# EAGLE design Main V3 (EAGLE 9.6.2)
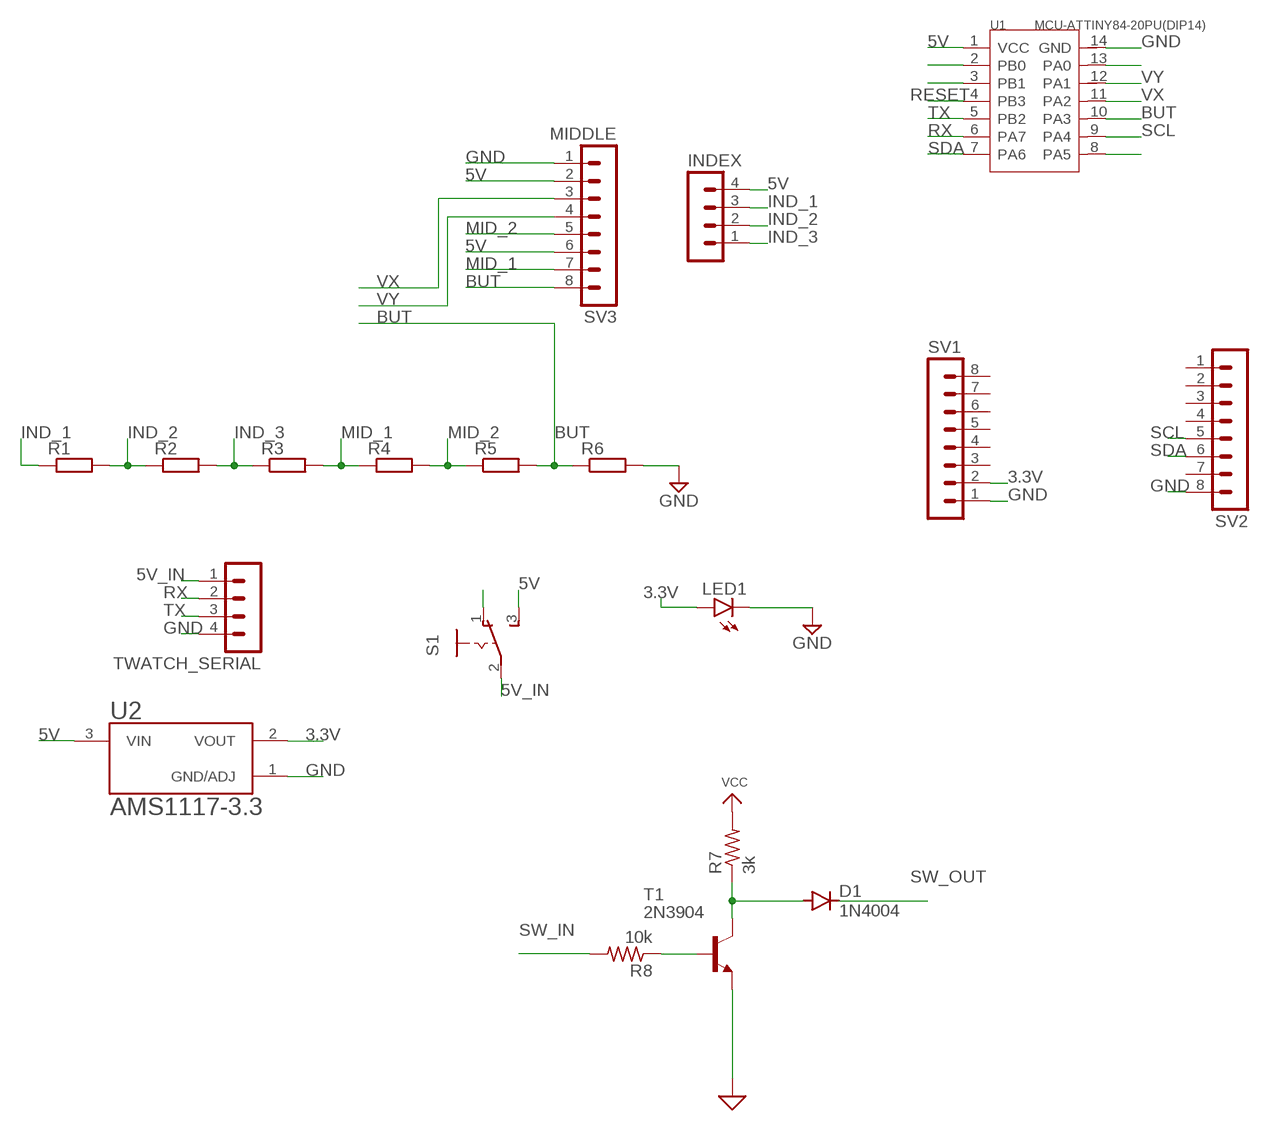
[diagram p0: schematic, sheet 1]

## Parts
D1  1N4004  [DO41-10]
INDEX  MA04-1  [MA04-1]
LED1  LED5MM  [LED5MM]
R1  R-EU_0204/7  [0204/7]
R2  R-EU_0204/7  [0204/7]
R3  R-EU_0204/7  [0204/7]
R4  R-EU_0204/7  [0204/7]
R5  R-EU_0204/7  [0204/7]
R6  R-EU_0204/7  [0204/7]
R7  3k  R-US_0204/5  [0204/5]
R8  10k  R-US_0204/5  [0204/5]
S1  255SB  [255SB]
SV1  MA08-1  [MA08-1]
SV2  MA08-1  [MA08-1]
SV3  MIDDLE  MA08-1  [MA08-1]
T1  2N3904  [TO92]
TWATCH_SERIAL  MA04-1  [MA04-1]
U1  MCU-ATTINY84-20PU(DIP14)  [DIP14-2.54-17.24X6.35MM]
U2  AMS1117-3.3  [SOT229P700X180-4N]

## Nets
3.3V: LED1.A SV1.2 U2.2(VOUT)
5V: INDEX.4 S1.3(S) SV3.2 SV3.6 U1.1(VCC) U2.3(VIN)
5V_IN: S1.2(P) TWATCH_SERIAL.1
BUT: R5.2 R6.1 SV3.8 U1.10(PA3)
GND: LED1.K(C) R6.2 SV1.1 SV2.8 SV3.1 T1.3(E) TWATCH_SERIAL.4 U1.14(GND) U2.1(GND/ADJ) ; supply symbol labelled SUP
IND_1: INDEX.3 R1.1
IND_2: INDEX.2 R1.2 R2.1
IND_3: INDEX.1 R2.2 R3.1
MID_1: R3.2 R4.1 SV3.7
MID_2: R4.2 R5.1 SV3.5
N$2: S1.1(O)
N$3: U1.2(PB0)
N$4: U1.3(PB1)
N$5: R8.1 T1.2(B)
N$6: D1.A R7.1 T1.1(C)
N$9: U1.8(PA5)
N$14: U1.13(PA0)
RESET: U1.4(PB3)
RX: TWATCH_SERIAL.2 U1.6(PA7)
SCL: SV2.5 U1.9(PA4)
SDA: SV2.6 U1.7(PA6)
SW_IN: R8.2
SW_OUT: D1.C
TX: TWATCH_SERIAL.3 U1.5(PB2)
VCC: R7.2
VX: SV3.3 U1.11(PA2)
VY: SV3.4 U1.12(PA1)
Unconnected: SV1.3 SV1.4 SV1.5 SV1.6 SV1.7 SV1.8 SV2.1 SV2.2 SV2.3 SV2.4 SV2.7

## Library data of the parts
D1 = diode:1N4004: DIODE general purpose rectifier, 1 A
INDEX TWATCH_SERIAL = con-lstb:MA04-1: PIN HEADER; OC_FARNELL: unknown; OC_NEWARK: unknown
LED1 = led:LED: LED OSRAM: - CHIPLED LG R971, LG N971, LY N971, LG Q971, LY Q971, LO R971, LY R971 LH N974, LH R974 LS Q976, LO Q976, LY Q976 LO Q996 - Hyper CHIPLED LW Q18S LB Q993, LB Q99A, LB R99A - SideLED LS A670, LO A670, LY A670, LG A670, LP A670 LB A673, LV A673, LT A673, LW A673 LH A674 LY A675 LS A676, LA A676, LO A676, LY A676, LW A676 LS A679, LY A679, LG A679 - Hyper Micro SIDELED® LS Y876, LA Y876, LO Y876, LY Y876 LT Y87S - SmartLED LW L88C, LW L88S LB L89C, LB L89S, LG L890 LS L89K, LO L89K, LY L89K LS L896, LA L896, LO L896, LY L896 - TOPLED LS T670, LO T670, LY T670, LG T670, LP T670 LSG T670, LSP T670, LSY T670, LOP T670, LYG T670 LG T671, LOG T671, LSG T671 LB T673, LV T673, LT T673, LW T673 LH T674 LS T676, LA T676, LO T676, LY T676, LB T676, LH T676, LSB T676, LW T676 LB T67C, LV T67C, LT T67C, LS T67K, LO T67K, LY T67K, LW E67C LS E67B, LA E67B, LO E67B, LY E67B, LB E67C, LV E67C, LT E67C LW T67C LS T679, LY T679, LG T679 LS T770, LO T770, LY T770, LG T770, LP T770 LB T773, LV T773, LT T773, LW T773 LH T774 LS E675, LA E675, LY E675, LS T675 LS T776, LA T776, LO T776, LY T776, LB T776 LHGB T686 LT T68C, LB T68C - Hyper Mini TOPLED® LB M676 - Mini TOPLED Santana® LG M470 LS M47K, LO M47K, LY M47K Source: http://www.osram.convergy.de LUXEON: - LUMILED® LXK2-PW12-R00, LXK2-PW12-S00, LXK2-PW14-U00, LXK2-PW14-V00 LXK2-PM12-R00, LXK2-PM12-S00, LXK2-PM14-U00 LXK2-PE12-Q00, LXK2-PE12-R00, LXK2-PE12-S00, LXK2-PE14-T00, LXK2-PE14-U00 LXK2-PB12-K00, LXK2-PB12-L00, LXK2-PB12-M00, LXK2-PB14-N00, LXK2-PB14-P00, LXK2-PB14-Q00 LXK2-PR12-L00, LXK2-PR12-M00, LXK2-PR14-Q00, LXK2-PR14-R00 LXK2-PD12-Q00, LXK2-PD12-R00, LXK2-PD12-S00 LXK2-PH12-R00, LXK2-PH12-S00 LXK2-PL12-P00, LXK2-PL12-Q00, LXK2-PL12-R00 Source: www.luxeon.com KINGBRIGHT: KA-3528ASYC Source: www.kingbright.com
R1-R6 = rcl:R-EU_: RESISTOR, European symbol; SPICEPREFIX: R
R7 R8 = resistor:R-US_: RESISTOR, American symbol
S1 = switch:255SB: SLIDING SWITCH Distributor Buerklin, 11G810
SV1-SV3 = con-lstb:MA08-1: PIN HEADER; OC_FARNELL: unknown; OC_NEWARK: unknown
T1 = transistor:2N3904: NPN TRANSISTOR
U1 = MCU-ATTINY84-20PU_DIP14_:MCU-ATTINY84-20PU(DIP14): 310010126 Check availability <https://pricing.snapeda.com/parts/ATTINY84-20PU/Microchip/view-part?ref=eda>; AVAILABILITY: In Stock; DESCRIPTION: AVR AVR® ATtiny Microcontroller IC 8-Bit 20MHz 8KB (4K x 16) FLASH 14-PDIP; MF: Microchip; MP: ATTINY84-20PU; PACKAGE: DIP-14 Microchip; PRICE: None; PURCHASE-URL: https://pricing.snapeda.com/search/part/ATTINY84-20PU/?ref=eda
U2 = AMS1117-3.3:AMS1117-3.3: Check availability <https://pricing.snapeda.com/parts/AMS1117-3.3/Advanced%20Monolithic%20Systems/view-part?ref=eda>; AVAILABILITY: Not in stock; DESCRIPTION: Sot223/Pkg 1-Amp 3.3-Volt Low Drop Out Voltage Regulatator; MF: Advanced Monolithic Systems; MP: AMS1117-3.3; PACKAGE: SOT-223 Seeed Technology; PRICE: None

## Board
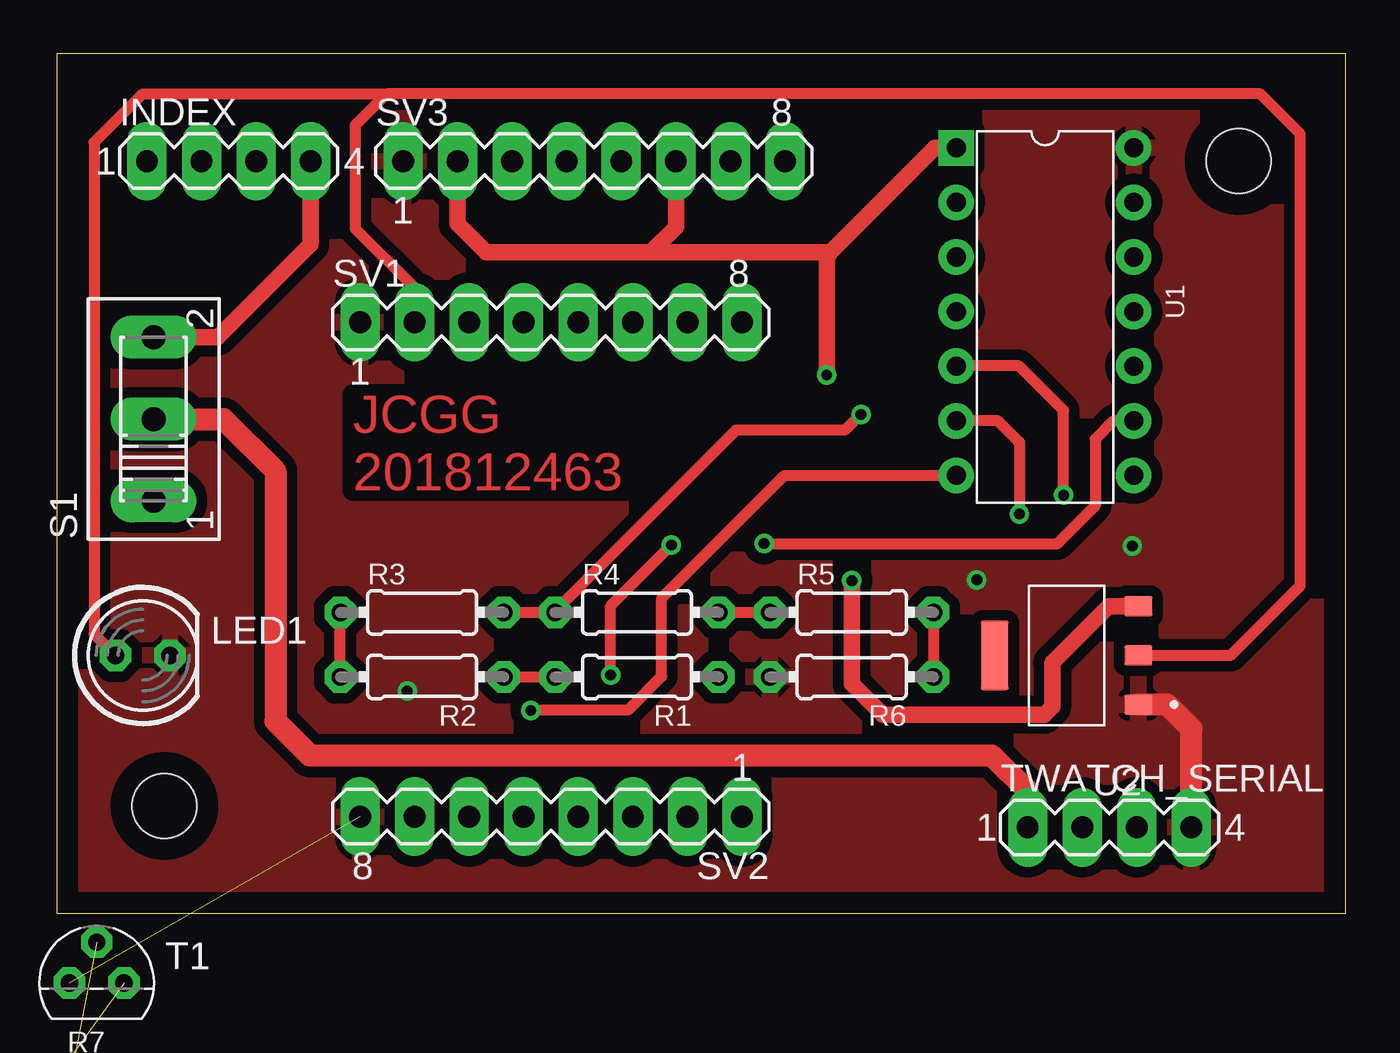
[diagram p1: board, top side]
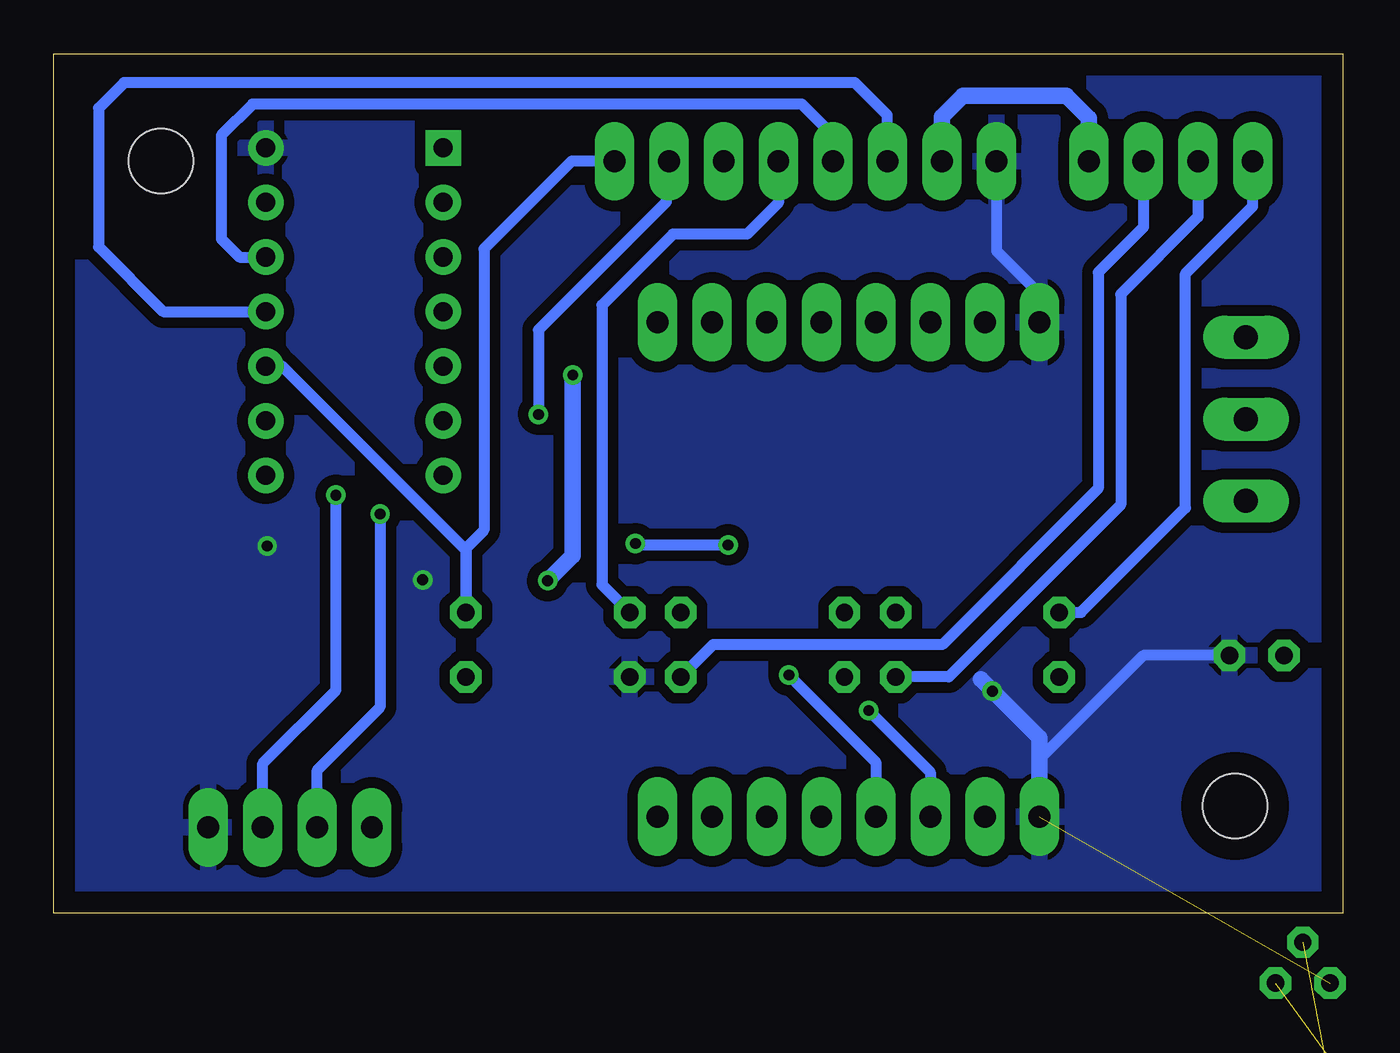
[diagram p2: board, bottom side, seen from below]

Size 60 x 40 mm. Coordinates in mm from the lower left corner, seen from the top.
Outline: 0,0 60,0 60,40 0,40 0,0
Copper layers (1*16): Top 0.035mm / dielectric 1.5mm / Bottom 0.035mm
Design rules "default *": minimum track width 6mil, minimum drill 0.35mm, track to track 0.5mm, track to pad 0.5mm, pad to pad 0.5mm, via to via 0.5mm, smd to smd 6mil, copper to edge 1mm, drill to drill 6mil, minimum pad ring 10mil, minimum via ring 8mil, stop-mask expansion 4mil, vias tented up to drill 0mil, thermal gap 10mil
Holes 3 mm at 5,5 55,35
bKeepout: area 10,3 to 39,29

### Footprints (pad centres in the part's own frame; a part is rotated, then mirrored left to right if it is on the bottom)
DO41-10 = drill 1.118: A 5.08,0; C -5.08,0
MA04-1 = drill 1.016 long: 1 -3.81,0; 2 -1.27,0; 3 1.27,0; 4 3.81,0
LED5MM = drill 0.813 octagon: A -1.27,0; K 1.27,0
0204/7 = drill 0.813 octagon: 1 -3.81,0; 2 3.81,0
0204/5 = drill 0.813 octagon: 1 -2.54,0; 2 2.54,0
255SB = drill 1.118 long: 1 -3.81,0; 2 0,0; 3 3.81,0
MA08-1 = drill 1.016 long: 1 -8.89,0; 2 -6.35,0; 3 -3.81,0; 4 -1.27,0; 5 1.27,0; 6 3.81,0; 7 6.35,0; 8 8.89,0
TO92 = drill 0.813 octagon: 1 1.27,0; 2 0,1.905; 3 -1.27,0
DIP14-2.54-17.24X6.35MM = drill 0.889 pad 1.651 square: 1 -7.62,-4.128 | drill 0.889 pad 1.651: 2 -5.08,-4.128; 3 -2.54,-4.128; 4 0,-4.128; 5 2.54,-4.128; 6 5.08,-4.128; 7 7.62,-4.128; 8 7.62,4.128; 9 5.08,4.128; 10 2.54,4.128; 11 0,4.128; 12 -2.54,4.128; 13 -5.08,4.128; 14 -7.62,4.128
SOT229P700X180-4N = smd 1.31 x 0.93: 1 -3.345,2.29; 2 -3.345,0; 3 -3.345,-2.29 | smd 1.31 x 3.24: 4 3.345,0

### Placement (x,y rotation side)
D1  5.31,-15.77 0 top  (outside the outline)
INDEX  8,35 0 top
LED1  4,12 0 top
R1  27,11 180 top
R2  17,11 180 top
R3  17,14 0 top
R4  27,14 0 top
R5  37,14 0 top
R6  37,11 180 top
R7  2.49,-7.65 0 top  (outside the outline)
R8  2.49,-11.28 0 top  (outside the outline)
S1  4.5,23 90 top
SV1  23,27.5 0 top
SV2  23,4.5 180 top
SV3  25,35 0 top
T1  1.85,-3.25 0 top
TWATCH_SERIAL  49,4 0 top
U1  46,28 270 top
U2  47,12 180 top

### Tracks (layer width: path | path; a pad name or v marks a point on that pad's centre or on a via)
3.3V
  Top 0.508: SV1.2 16.65,29.11 13.89,31.86 13.89,36.68 15.35,38.13 | U2.2 54.65,12 57.88,15.23 57.88,36.27 56.01,38.13 15.35,38.13 | LED1.A 1.73,13 1.73,35.87 4,38.13 15.35,38.13
5V  (via drill 0.5)
  Top 0.762: S1.3 7.48,26.81 11.81,31.14 INDEX.4 | SV3.2 18.65,32.1 19.99,30.76 27.64,30.76 | 27.64,30.76 36.02,30.76 | U1.1 40.88,35.62 36.02,30.76 | U2.3 48.96,14.29 46.33,11.66 46.33,9.6 45.96,9.23 38.46,9.23 37.01,10.68 v37.01,15.48 | v35.84,25.04 35.84,30.58 36.02,30.76 | 27.64,30.76 28.81,31.93 SV3.6
  Bottom 0.762: INDEX.4 11.81,37.01 12.85,38.05 17.68,38.05 18.65,37.08 SV3.2 | v37.01,15.48 35.84,16.65 v35.84,25.04
5V_IN
  Top 1.016: S1.2 7.75,23 10.18,20.57 10.18,8.94 11.78,7.34 43.53,7.34 45.19,5.68 TWATCH_SERIAL.1
BUT
  Top 0.508: R5.2 R6.1
  Bottom 0.508: SV3.8 35.89,35 39.97,30.92 39.97,17.83 40.81,16.99 R5.2 40.81,16.89 49.38,25.46 U1.10
GND  (via drill 0.5)  (1 unrouted)
  Top 1.016: TWATCH_SERIAL.4 52.81,8.59 51.69,9.71 U2.1
  Bottom 0.508: SV1.1 14.11,28.82 16.11,30.82 SV3.1 | LED1.K 9.27,12 14.11,7.16 SV2.8
  Bottom 0.762: SV2.8 14.11,8.17 16.84,10.89
  other vias: 16.3,10.34 50.06,17.09 42.82,15.52
  pour Top: 0,0 0,40 60,40 60,0
  pour Bottom: 0,0 0,40 60,40 60,0
IND_1
  Bottom 0.508: INDEX.3 9.27,31.93 11.37,29.82 11.37,19.77 18.64,12.51 29.3,12.51 R1.1
IND_2
  Top 0.508: R2.1 R1.2
  Bottom 0.508: INDEX.2 6.73,32.41 10.33,28.8 10.33,19 18.33,11 R2.1
IND_3
  Top 0.508: R2.2 R3.1
  Bottom 0.508: INDEX.1 4.19,32.89 7.32,29.77 7.32,18.87 12.18,14 R3.1
MID_1  (via drill 0.5)
  Top 0.508: R3.2 R4.1 23.19,14.06 31.61,22.48 36.7,22.48 v37.43,23.22
  Bottom 0.508: SV3.7 31.5,34.85 31.5,33.09 37.43,27.15 v37.43,23.22
MID_2
  Top 0.508: R4.2 R5.1
  Bottom 0.508: SV3.5 26.27,33.06 27.72,31.61 31.18,31.61 34.48,28.3 34.48,15.29 R5.1
N$5  (1 unrouted)
N$6  (2 unrouted)
RX  (via drill 0.5)
  Top 0.508: v44.81,18.58 44.81,21.93 43.81,22.92 U1.6
  Bottom 0.508: v44.81,18.58 44.81,9.59 47.73,6.67 TWATCH_SERIAL.2
SCL  (via drill 0.5)
  Top 0.508: v25.77,11.08 25.77,14.31 v28.61,17.14 | v32.92,17.2 46.58,17.2 48.33,18.95 48.33,22.07 49.19,22.92 U1.9
  Bottom 0.508: SV2.5 21.73,7.04 v25.77,11.08 | v32.92,17.2 32.86,17.14 v28.61,17.14
SDA  (via drill 0.5)
  Top 0.508: v22.07,9.44 22.08,9.46 26.59,9.46 28.16,11.03 28.16,14.66 33.87,20.38 U1.7
  Bottom 0.508: v22.07,9.44 19.19,6.57 SV2.6
TX  (via drill 0.5)
  Top 0.508: U1.5 41.89,25.48 44.79,25.48 46.86,23.4 v46.86,19.46
  Bottom 0.508: TWATCH_SERIAL.3 50.27,6.98 46.86,10.39 v46.86,19.46
VX
  Bottom 0.508: SV3.3 21.19,37.14 22.71,38.66 56.72,38.66 57.91,37.47 57.91,31.01 54.9,28 U1.11
VY
  Bottom 0.508: SV3.4 23.73,36.21 25.17,37.65 50.74,37.65 52.2,36.2 52.2,31.39 51.35,30.54 U1.12

### Text on the board
Top: JCGG / 201812463